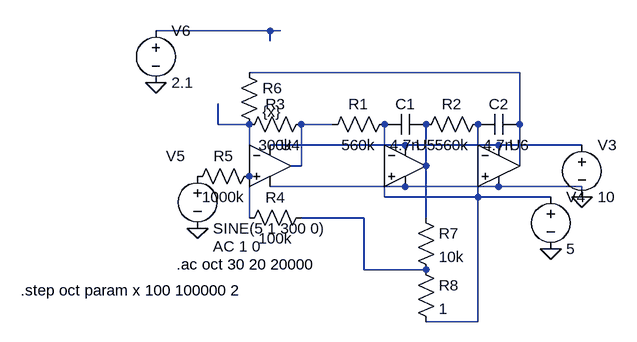
[diagram p0: schematic SVFwahthang.asc]
SVFwahthang.asc, the LTspice schematic file:
Version 4
SHEET 1 880 680
WIRE -1120 176 -1296 176
WIRE -1104 176 -1120 176
WIRE -1120 192 -1120 176
WIRE -736 240 -1152 240
WIRE -1200 320 -1200 288
WIRE -1152 320 -1200 320
WIRE -1024 320 -1072 320
WIRE -736 320 -736 240
WIRE -912 352 -1120 352
WIRE -768 352 -912 352
WIRE -640 352 -768 352
WIRE -1152 368 -1152 320
WIRE -944 368 -944 320
WIRE -800 368 -800 320
WIRE -1072 384 -1072 320
WIRE -1072 384 -1088 384
WIRE -880 384 -880 320
WIRE -736 384 -736 320
WIRE -912 416 -1120 416
WIRE -768 416 -912 416
WIRE -640 416 -768 416
WIRE -944 432 -944 400
WIRE -800 432 -800 400
WIRE -800 432 -944 432
WIRE -688 432 -800 432
WIRE -640 432 -640 416
WIRE -1152 464 -1152 400
WIRE -976 464 -1072 464
WIRE -880 464 -880 384
WIRE -976 544 -976 464
WIRE -880 544 -976 544
WIRE -800 624 -800 432
WIRE -800 624 -880 624
FLAG -640 432 0
FLAG -688 512 0
FLAG -1232 480 0
FLAG -1296 256 0
SYMBOL Opamps\\UniversalOpamp2 -1120 384 R0
SYMATTR InstName U4
SYMBOL Opamps\\UniversalOpamp2 -912 384 R0
SYMATTR InstName U5
SYMBOL voltage -640 336 R0
WINDOW 123 0 0 Left 0
WINDOW 39 0 0 Left 0
SYMATTR InstName V3
SYMATTR Value 10
SYMBOL cap -880 304 R90
WINDOW 0 0 32 VBottom 2
WINDOW 3 32 32 VTop 2
SYMATTR InstName C1
SYMATTR Value 4.7n
SYMBOL res -928 304 R90
WINDOW 0 0 56 VBottom 2
WINDOW 3 32 56 VTop 2
SYMATTR InstName R1
SYMATTR Value 560k
SYMBOL voltage -688 416 R0
WINDOW 123 0 0 Left 0
WINDOW 39 0 0 Left 0
SYMATTR InstName V4
SYMATTR Value 5
SYMBOL Opamps\\UniversalOpamp2 -768 384 R0
SYMATTR InstName U6
SYMBOL cap -736 304 R90
WINDOW 0 0 32 VBottom 2
WINDOW 3 32 32 VTop 2
SYMATTR InstName C2
SYMATTR Value 4.7n
SYMBOL res -784 304 R90
WINDOW 0 0 56 VBottom 2
WINDOW 3 32 56 VTop 2
SYMATTR InstName R2
SYMATTR Value 560k
SYMBOL res -1056 304 R90
WINDOW 0 0 56 VBottom 2
WINDOW 3 32 56 VTop 2
SYMATTR InstName R3
SYMATTR Value 300k
SYMBOL res -1056 448 R90
WINDOW 0 0 56 VBottom 2
WINDOW 3 32 56 VTop 2
SYMATTR InstName R4
SYMATTR Value 100k
SYMBOL res -1136 384 R90
WINDOW 0 0 56 VBottom 2
WINDOW 3 32 56 VTop 2
SYMATTR InstName R5
SYMATTR Value 1000k
SYMBOL voltage -1232 384 R0
WINDOW 0 -48 -15 Left 2
WINDOW 123 24 124 Left 2
WINDOW 39 0 0 Left 0
SYMATTR InstName V5
SYMATTR Value2 AC 1 0
SYMATTR Value SINE(5 1 300 0)
SYMBOL res -1168 224 R0
SYMATTR InstName R6
SYMATTR Value {x}
SYMBOL voltage -1296 160 R0
WINDOW 123 0 0 Left 0
WINDOW 39 0 0 Left 0
SYMATTR InstName V6
SYMATTR Value 2.1
SYMBOL res -896 448 R0
SYMATTR InstName R7
SYMATTR Value 10k
SYMBOL res -896 528 R0
SYMATTR InstName R8
SYMATTR Value 1
TEXT -1264 536 Left 2 !.ac oct 30 20 20000
TEXT -1504 576 Left 2 !.step oct param x 100 100000 2

The netlist it stands for:
* SVFwahthang.asc
XU4 N010 N003 N005 0 N004 level.2 Avol=1Meg GBW=10Meg Slew=10Meg ilimit=25m rail=0 Vos=0 phimargin=45 en=0 enk=0 in=0 ink=0 Rin=500Meg  ; pins IN+ IN- V+ V- OUT
XU5 N009 N006 N005 0 N008 level.2 Avol=1Meg GBW=10Meg Slew=10Meg ilimit=25m rail=0 Vos=0 phimargin=45 en=0 enk=0 in=0 ink=0 Rin=500Meg  ; pins IN+ IN- V+ V- OUT
V3 N005 0 10
C1 N008 N006 4.7n
R1 N006 N004 560k
V4 N009 0 5
XU6 N009 N007 N005 0 N002 level.2 Avol=1Meg GBW=10Meg Slew=10Meg ilimit=25m rail=0 Vos=0 phimargin=45 en=0 enk=0 in=0 ink=0 Rin=500Meg  ; pins IN+ IN- V+ V- OUT
C2 N002 N007 4.7n
R2 N007 N008 560k
R3 N004 N003 300k
R4 N011 N010 100k
R5 N010 P001 1000k
V5 P001 0 SINE(5 1 300 0) AC 1 0
R6 N002 N003 {x}
V6 N001 0 2.1
R7 N008 N011 10k
R8 N011 N009 1
.ac oct 30 20 20000
.step oct param x 100 100000 2
.lib UniversalOpamps2.sub
.backanno
.end